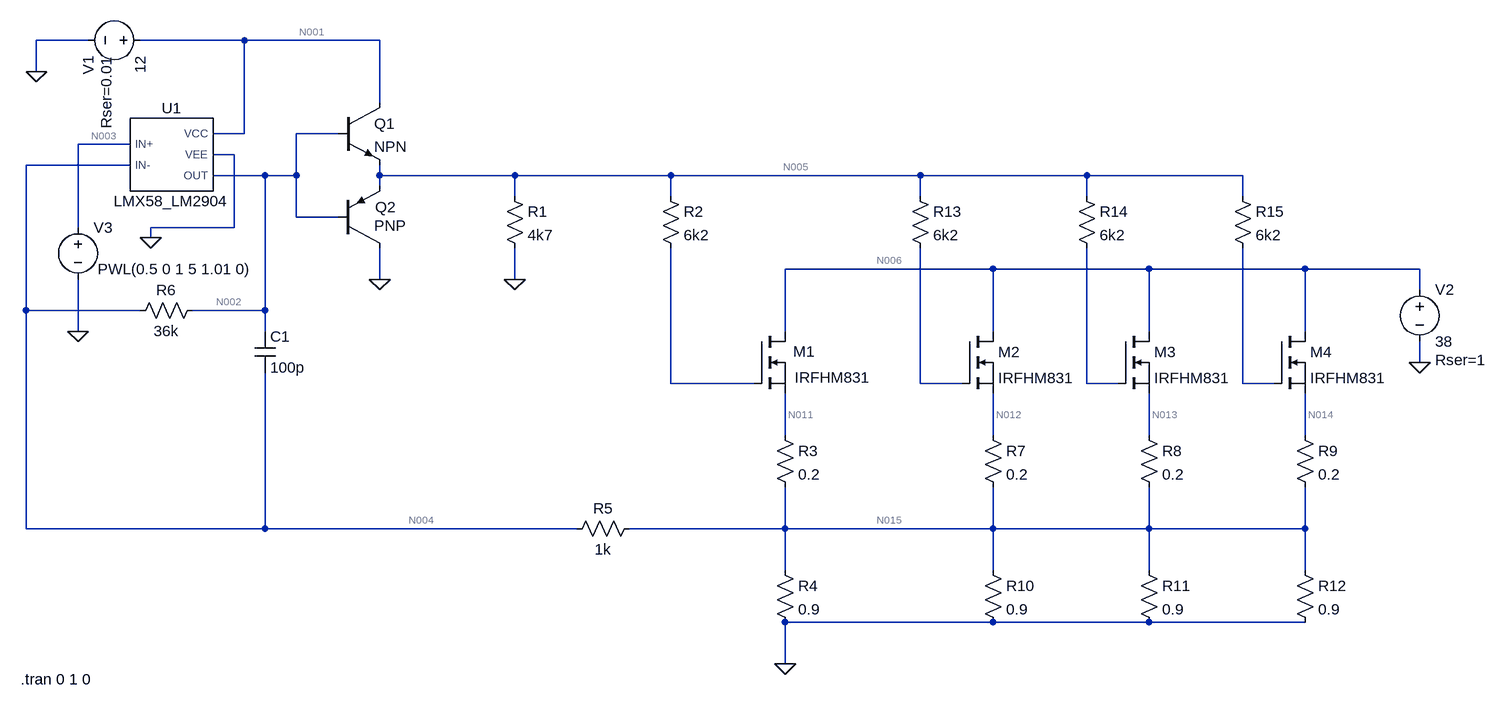
[diagram p0: schematic simulation.asc]
simulation.asc, the LTspice schematic file:
Version 4
SHEET 1 2404 968
WIRE 48 -64 -32 -64
WIRE 288 -64 128 -64
WIRE 496 -64 288 -64
WIRE -32 -16 -32 -64
WIRE 496 32 496 -64
WIRE 288 80 288 -64
WIRE 288 80 240 80
WIRE 432 80 368 80
WIRE 112 96 32 96
WIRE 272 112 240 112
WIRE 112 128 -48 128
WIRE 320 144 240 144
WIRE 368 144 368 80
WIRE 368 144 320 144
WIRE 496 144 496 128
WIRE 704 144 496 144
WIRE 944 144 704 144
WIRE 1328 144 944 144
WIRE 1584 144 1328 144
WIRE 1824 144 1584 144
WIRE 496 160 496 144
WIRE 704 176 704 144
WIRE 944 176 944 144
WIRE 1328 176 1328 144
WIRE 1584 176 1584 144
WIRE 1824 176 1824 144
WIRE 368 208 368 144
WIRE 432 208 368 208
WIRE 32 224 32 96
WIRE 272 224 272 112
WIRE 272 224 144 224
WIRE 144 240 144 224
WIRE 1440 288 1120 288
WIRE 1680 288 1440 288
WIRE 1920 288 1680 288
WIRE 2096 288 1920 288
WIRE 496 304 496 256
WIRE 704 304 704 256
WIRE 2096 320 2096 288
WIRE -48 352 -48 128
WIRE 128 352 -48 352
WIRE 320 352 320 144
WIRE 320 352 208 352
WIRE 32 384 32 304
WIRE 320 384 320 352
WIRE 1120 384 1120 288
WIRE 1440 384 1440 288
WIRE 1680 384 1680 288
WIRE 1920 384 1920 288
WIRE 2096 432 2096 400
WIRE 944 464 944 256
WIRE 1072 464 944 464
WIRE 1328 464 1328 256
WIRE 1392 464 1328 464
WIRE 1584 464 1584 256
WIRE 1632 464 1584 464
WIRE 1824 464 1824 256
WIRE 1872 464 1824 464
WIRE 1120 544 1120 480
WIRE 1440 544 1440 480
WIRE 1680 544 1680 480
WIRE 1920 544 1920 480
WIRE -48 688 -48 352
WIRE 320 688 320 448
WIRE 320 688 -48 688
WIRE 800 688 320 688
WIRE 1120 688 1120 624
WIRE 1120 688 880 688
WIRE 1440 688 1440 624
WIRE 1440 688 1120 688
WIRE 1680 688 1680 624
WIRE 1680 688 1440 688
WIRE 1920 688 1920 624
WIRE 1920 688 1680 688
WIRE 1120 752 1120 688
WIRE 1440 752 1440 688
WIRE 1680 752 1680 688
WIRE 1920 752 1920 688
WIRE 1440 832 1120 832
WIRE 1680 832 1440 832
WIRE 1920 832 1680 832
WIRE 1120 896 1120 832
FLAG 144 240 0
FLAG 496 304 0
FLAG -32 -16 0
FLAG 704 304 0
FLAG 1120 896 0
FLAG 2096 432 0
FLAG 32 384 0
SYMBOL voltage 144 -64 R90
WINDOW 0 24 96 Left 2
WINDOW 3 24 16 Left 2
WINDOW 123 0 0 Left 0
WINDOW 39 24 68 Left 2
SYMATTR InstName V1
SYMATTR Value 12
SYMATTR SpiceLine Rser=0.01
SYMBOL npn 432 32 R0
SYMATTR InstName Q1
SYMBOL pnp 432 256 M180
WINDOW 0 57 63 Left 2
WINDOW 3 56 35 Left 2
SYMATTR InstName Q2
SYMBOL res 688 160 R0
SYMATTR InstName R1
SYMATTR Value 4k7
SYMBOL res 928 160 R0
SYMATTR InstName R2
SYMATTR Value 6k2
SYMBOL nmos 1072 384 R0
WINDOW 0 94 31 Right 2
WINDOW 3 180 71 Right 2
SYMATTR InstName M1
SYMATTR Value IRFHM831
SYMBOL res 1104 528 R0
SYMATTR InstName R3
SYMATTR Value 0.2
SYMBOL res 1104 736 R0
SYMATTR InstName R4
SYMATTR Value 0.9
SYMBOL voltage 2096 304 R0
WINDOW 123 0 0 Left 0
WINDOW 39 24 124 Left 2
SYMATTR SpiceLine Rser=1
SYMATTR InstName V2
SYMATTR Value 38
SYMBOL voltage 32 208 R0
WINDOW 3 30 80 Left 2
WINDOW 123 0 0 Left 0
SYMATTR Value PWL(0.5 0 1 5 1.01 0)
SYMATTR InstName V3
SYMATTR SpiceLine Rser=1 Cpar=0
SYMBOL cap 304 384 R0
SYMATTR InstName C1
SYMATTR Value 100p
SYMATTR SpiceLine V=50 Irms=0 Rser=0.0708016 Lser=372.654p mfg="Würth Elektronik" pn="885012005061 WCAP-CSGP 0402" type="NP0"
SYMBOL nmos 1392 384 R0
SYMATTR InstName M2
SYMATTR Value IRFHM831
SYMBOL nmos 1632 384 R0
SYMATTR InstName M3
SYMATTR Value IRFHM831
SYMBOL nmos 1872 384 R0
SYMATTR InstName M4
SYMATTR Value IRFHM831
SYMBOL res 1424 528 R0
SYMATTR InstName R7
SYMATTR Value 0.2
SYMBOL res 1664 528 R0
SYMATTR InstName R8
SYMATTR Value 0.2
SYMBOL res 1904 528 R0
SYMATTR InstName R9
SYMATTR Value 0.2
SYMBOL res 1424 736 R0
SYMATTR InstName R10
SYMATTR Value 0.9
SYMBOL res 1664 736 R0
SYMATTR InstName R11
SYMATTR Value 0.9
SYMBOL res 1904 736 R0
SYMATTR InstName R12
SYMATTR Value 0.9
SYMBOL res 1312 160 R0
SYMATTR InstName R13
SYMATTR Value 6k2
SYMBOL res 1568 160 R0
SYMATTR InstName R14
SYMATTR Value 6k2
SYMBOL res 1808 160 R0
SYMATTR InstName R15
SYMATTR Value 6k2
SYMBOL res 896 672 R90
WINDOW 0 0 56 VBottom 2
WINDOW 3 32 56 VTop 2
SYMATTR InstName R5
SYMATTR Value 1k
SYMBOL LMX58_LM2904 176 112 R0
SYMATTR InstName U1
SYMBOL res 224 336 R90
WINDOW 0 0 56 VBottom 2
WINDOW 3 32 56 VTop 2
SYMATTR InstName R6
SYMATTR Value 36k
TEXT -56 920 Left 2 !.tran 0 1 0

The netlist it stands for:
* simulation.asc
V1 N001 0 12 Rser=0.01
Q1 N001 N002 N005 0 NPN
Q2 0 N002 N005 0 PNP
R1 N005 0 4k7
R2 N005 N007 6k2
M1 N006 N007 N011 N011 IRFHM831
R3 N011 N015 0.2
R4 N015 0 0.9
V2 N006 0 38 Rser=1
V3 N003 0 PWL(0.5 0 1 5 1.01 0) Rser=1 Cpar=0
C1 N002 N004 100p V=50 Irms=0 Rser=0.0708016 Lser=372.654p mfg="Würth Elektronik" pn="885012005061 WCAP-CSGP 0402" type="NP0"
M2 N006 N008 N012 N012 IRFHM831
M3 N006 N009 N013 N013 IRFHM831
M4 N006 N010 N014 N014 IRFHM831
R7 N012 N015 0.2
R8 N013 N015 0.2
R9 N014 N015 0.2
R10 N015 0 0.9
R11 N015 0 0.9
R12 N015 0 0.9
R13 N005 N008 6k2
R14 N005 N009 6k2
R15 N005 N010 6k2
R5 N015 N004 1k
XU1 N003 N004 N001 0 N002 LMX58_LM2904  ; pins IN+ IN- VCC VEE OUT
R6 N002 N004 36k
.model NPN NPN
.model PNP PNP
.lib standard.bjt
.model NMOS NMOS
.model PMOS PMOS
.lib standard.mos
.tran 0 1 0
.lib C:\Users\ajanu\PBL\load_pcb\pbl_utils_PCB\simulation\LMx58\lmx58_lm2904.lib
.backanno
.end

* Results of the author's LTspice run, read from the files saved beside the schematic
* Operating Point, zero values left out:
*   V(n001) = 12 V
*   V(n002) = 79.69 mV
*   V(n006) = 38 V
*   V(n011) = 488.7 nV
*   V(n015) = 488.6 nV
*   V(n004) = 2.172 mV
*   V(n012) = 488.7 nV
*   V(n013) = 488.7 nV
*   V(n014) = 488.7 nV
*   Ic(Q1) = 11.92 pA
*   Ib(Q1) = -11.84 pA
*   Id(M4) = 49.74 pA
*   Is(M4) = -49.74 pA
*   Id(M3) = 49.74 pA
*   Is(M3) = -49.74 pA
*   Id(M2) = 49.74 pA
*   Is(M2) = -49.74 pA
*   Id(M1) = 49.74 pA
*   Is(M1) = -49.74 pA
*   I(R6) = 2.153 µA
*   I(R5) = -2.171 µA
*   I(R12) = 542.9 nA
*   I(R11) = 542.9 nA
*   I(R10) = 542.9 nA
*   I(R9) = 85 pA
*   I(R8) = 85 pA
*   I(R7) = 85 pA
*   I(R4) = 542.9 nA
*   I(R3) = 85 pA
*   I(V3) = 20.01 nA
*   I(V2) = -331.9 pA
*   I(V1) = -352.2 µA
*   Ix(u1:IN+) = -20.01 nA
*   Ix(u1:IN-) = -18.01 nA
*   Ix(u1:VCC) = 352.2 µA
*   Ix(u1:VEE) = -350 µA
*   Ix(u1:OUT) = -2.153 µA
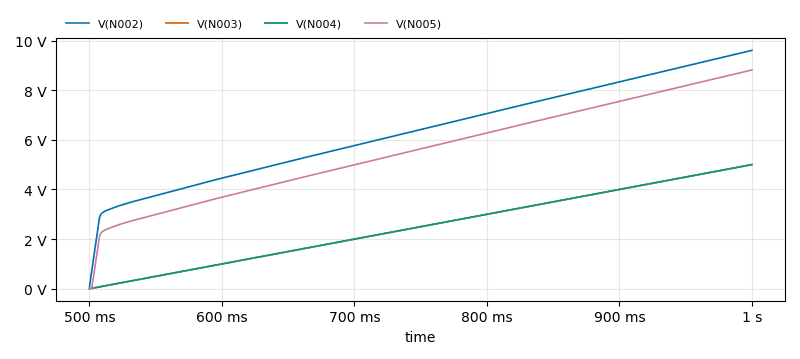
[diagram p1: Transient Analysis of simulation.asc, plotted from the saved traces]
* Transient Analysis, 1 run:
*   V(N002): min 79.69 mV, max 9.603 V, average 6.363 V, rms 6.693 V, last 9.603 V
*   V(N003): min 0 V, max 5 V, average 2.5 V, rms 2.944 V, last 5 V
*   V(N004): min 2.172 mV, max 5.002 V, average 2.502 V, rms 2.946 V, last 5.002 V
*   V(N005): min 0 V, max 8.813 V, average 5.588 V, rms 5.956 V, last 8.813 V